# Altium schematic sheet Master MicroController Port A.SchDoc: Master Micro Controller Port A Pin Out
size A4; DocumentNumber: 16; SheetNumber: 16; SheetTotal: 54
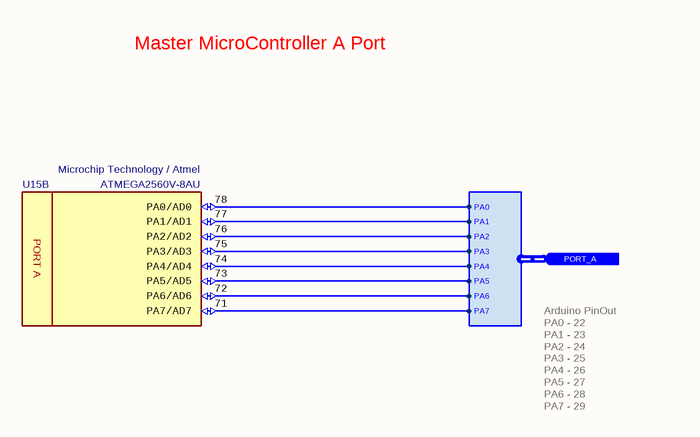
[diagram p0: Master MicroController Port A.SchDoc]

## Parts
U15  Manufacturer Part Number: ATMEGA2560V-8AU  Manufacturer Name: Microchip Technology / Atmel  [TQFP100]  (hidden comment: 8-bit MicroController)  (part B of 15)

## Ports
PORT_A (in, harness PORT_A)

## Harnesses
PORT_A: PA0, PA1, PA2, PA3, PA4, PA5, PA7, PA6

## Nets
NetU15_71: U15.71(PA7/AD7) ; port PORT_A.PA7
NetU15_72: U15.72(PA6/AD6) ; port PORT_A.PA6
NetU15_73: U15.73(PA5/AD5) ; port PORT_A.PA5
NetU15_74: U15.74(PA4/AD4) ; port PORT_A.PA4
NetU15_75: U15.75(PA3/AD3) ; port PORT_A.PA3
NetU15_76: U15.76(PA2/AD2) ; port PORT_A.PA2
NetU15_77: U15.77(PA1/AD1) ; port PORT_A.PA1
NetU15_78: U15.78(PA0/AD0) ; port PORT_A.PA0

## Notes on the sheet
- Master MicroController A Port
- Arduino PinOut
  PA0 - 22
  PA1 - 23
  PA2 - 24
  PA3 - 25
  PA4 - 26
  PA5 - 27
  PA6 - 28
  PA7 - 29
- Engineer
- All Rights are reserved to Customer and Engineer. [2021]
- Size:
- Date:
- A4
- Project :
- Time:
- Sheet
- of
- Customer
- Product ID
- Module ID
- Version
- File:
- Revision
- (in symbol IC - ATMEGA2560V-8AU, part B) PORT A

## Library data of the parts
U15 = IC - ATMEGA2560V-8AU: 8-bit Microcontrollers - MCU 256kB Flash 4kB EEPROM 86 I/O Pins; Supply Voltage - Min: 2V7; Supply Voltage - Max: 5.5V; Height: 1mm; ComponentLink1Description: DataSheet; ComponentLink1URL: https://eu.mouser.com/datasheet/2/268/Atmel-2549-8-bit-AVR-Microcontroller-ATmega640-128-1315286.pdf; ROHS: Yes; Minimum Operating Temperature: -40; Maximum Operating Temperature: +85; ComponentLink2Description: Mouser; ComponentLink2URL: https://eu.mouser.com/ProductDetail/Microchip-Technology-Atmel/ATMEGA2560V-8AU?qs=sGAEpiMZZMutXGli8Ay4kKlCYcvZUWqJYdtgGFyqFT8%3D; Supplier 1: Digi-Key; Supplier 2: Newark; Supplier 3: Avnet; Supplier 4: RSComponents; Supplier 5: RSComponents; Supplier Part Number 1: ATMEGA2560V-8AU-ND; Supplier Part Number 2: 68T2784; Supplier Part Number 3: 68T2784; Supplier Part Number 4: 1278284P; Supplier Part Number 5: 1278284; Case: TQFP-100; Supplier 6: Mouser; Supplier 7: Future Electronics; Supplier 8: Avnet; Supplier 9: Arrow Electronics; Supplier 10: Farnell; Supplier 11: Allied Electronics; Supplier 12: Future Electronics; Supplier 13: RSComponents; Supplier 14: RSComponents; Supplier 15: RSComponents; Supplier Part Number 6: 556-ATMEGA2560V8AU; Supplier Part Number 7: 4038198; Supplier Part Number 8: ATMEGA2560V-8AU; Supplier Part Number 9: ATMEGA2560V-8AU; Supplier Part Number 10: 1288331; Supplier Part Number 11: 70124009; Supplier Part Number 12: ATMEGA2560V-8AU-TRAY; Supplier Part Number 13: 6963424; Supplier Part Number 14: 6963424P; Supplier Part Number 15: 9220809